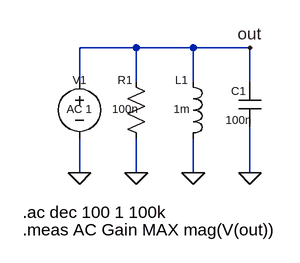
[diagram p0: schematic simple_resonant_modified_1.asc]
simple_resonant_modified_1.asc, the LTspice schematic file:
Version 4
SHEET 1 880 680
WIRE 160 -112 80 -112
WIRE 240 -112 160 -112
WIRE 320 -112 240 -112
WIRE 80 -64 80 -112
WIRE 160 -64 160 -112
WIRE 240 -64 240 -112
WIRE 320 -64 320 -112
WIRE 80 64 80 16
WIRE 160 64 160 16
WIRE 240 64 240 16
WIRE 320 64 320 0
FLAG 80 64 0
FLAG 160 64 0
FLAG 320 -112 out
FLAG 240 64 0
FLAG 320 64 0
SYMBOL voltage 80 -80 R0
WINDOW 0 0 24 Bottom 1
WINDOW 3 0 44 Top 1
SYMATTR InstName V1
SYMATTR Value AC 1
SYMATTR SpiceLine DC 0
SYMBOL res 144 -80 R0
WINDOW 0 0 24 Bottom 1
WINDOW 3 0 44 Top 1
SYMATTR InstName R1
SYMATTR Value 100n
SYMBOL ind 224 -80 R0
WINDOW 0 0 24 Bottom 1
WINDOW 3 0 44 Top 1
SYMATTR InstName L1
SYMATTR Value 1m
SYMBOL cap 304 -64 R0
WINDOW 0 0 24 Bottom 1
WINDOW 3 0 44 Top 1
SYMATTR InstName C1
SYMATTR Value 100n
TEXT 0 120 Left 2 !.ac dec 100 1 100k
TEXT 0 144 Left 2 !.meas AC Gain MAX mag(V(out))

The netlist it stands for:
* simple_resonant_modified_1.asc
V1 out 0 AC 1 DC 0
R1 out 0 100n
L1 out 0 1m
C1 out 0 100n
.ac dec 100 1 100k
.meas AC Gain MAX mag(V(out))
.backanno
.end